# EAGLE schematic ShutdownCircuitFH rev1 (EAGLE 8.3.1)
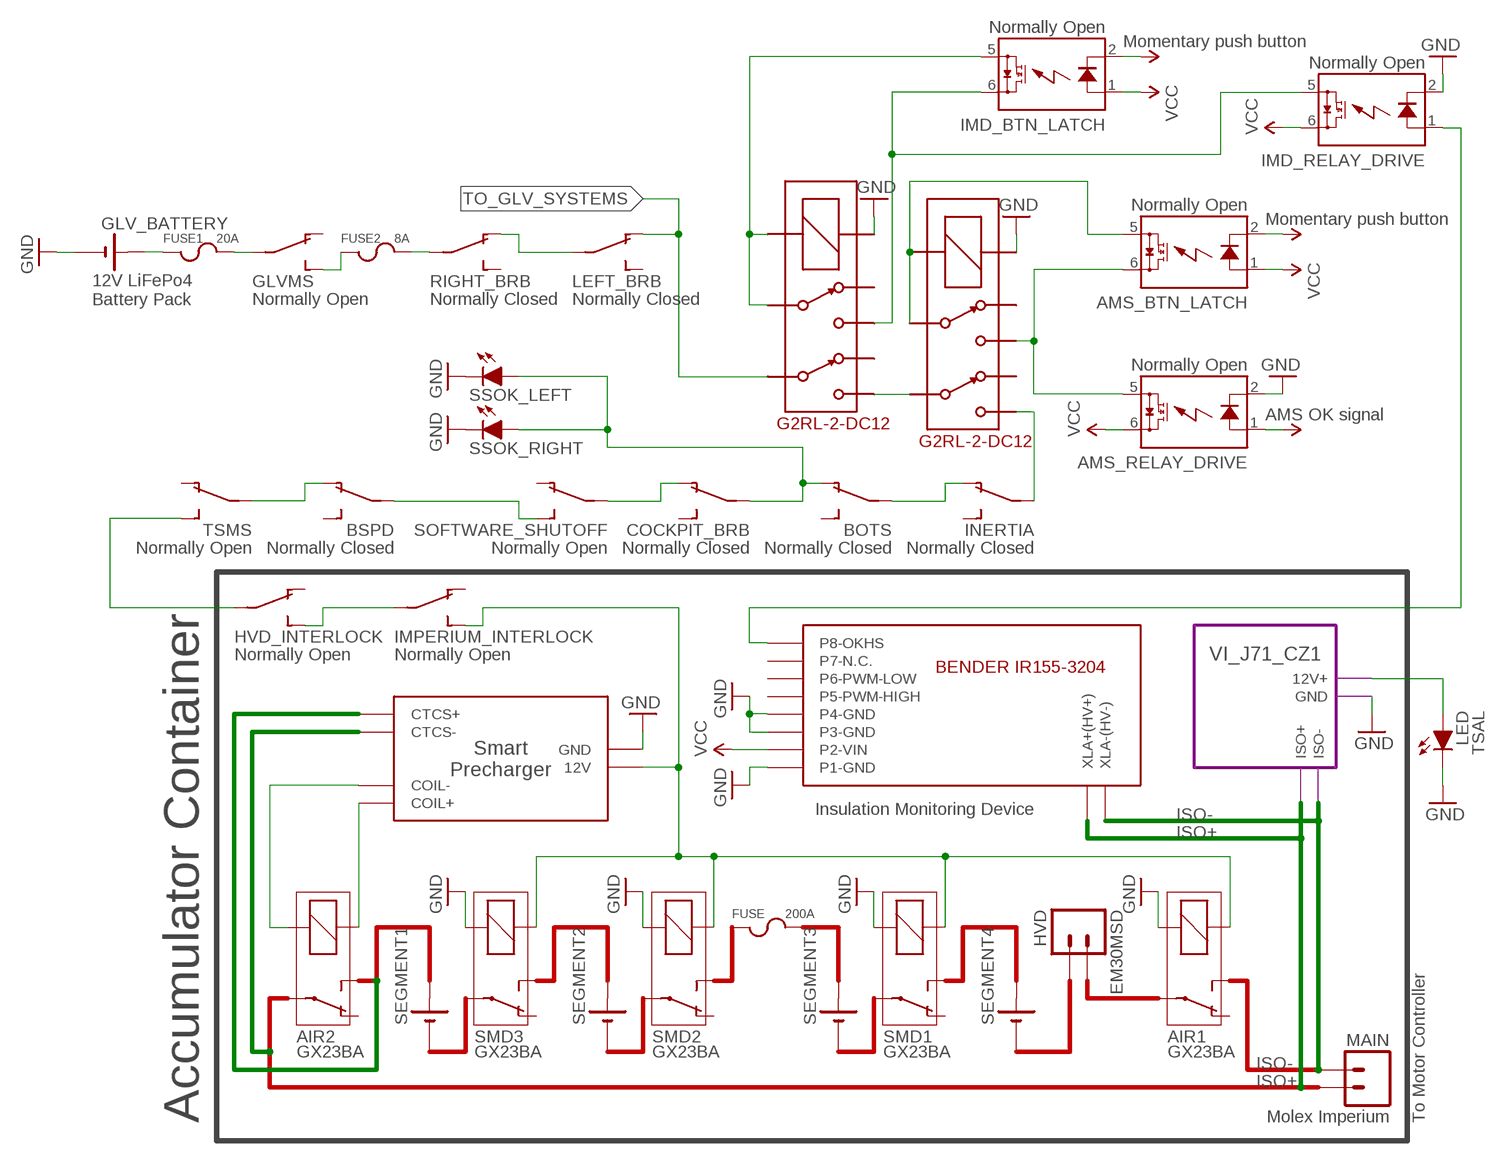
[diagram p0: schematic, sheet 1]

## Parts
AIR1  GX23BA  RELAY  (no package)
AIR2  GX23BA  RELAY  (no package)
AMS_BTN_LATCH  Normally Open  SOLID_STATE_RELAY_VO14642AT  [DIL06]
AMS_RELAY_DRIVE  Normally Open  SOLID_STATE_RELAY_VO14642AT  [DIL06]
BOTS  Normally Closed  SWITCH_SPST  (no package)
BSPD  Normally Closed  SWITCH_SPST  (no package)
COCKPIT_BRB  Normally Closed  SWITCH_SPST  (no package)
FUSE  200A  FUSE  (no package)
FUSE1  20A  FUSE  (no package)
FUSE2  8A  FUSE  (no package)
GLV_BATTERY  BATTERY_1_CELL  (no package)
GLVMS  Normally Open  SWITCH_SPST  (no package)
HVD  EM30MSD  M02  (no package)
HVD_INTERLOCK  Normally Open  SWITCH_SPST  (no package)
IMD_BTN_LATCH  Normally Open  SOLID_STATE_RELAY_VO14642AT  [DIL06]
IMD_RELAY_DRIVE  Normally Open  SOLID_STATE_RELAY_VO14642AT  [DIL06]
IMPERIUM_INTERLOCK  Normally Open  SWITCH_SPST  (no package)
INERTIA  Normally Closed  SWITCH_SPST  (no package)
LEFT_BRB  Normally Closed  SWITCH_SPST  (no package)
MAIN  Molex Imperium  M02  (no package)
RIGHT_BRB  Normally Closed  SWITCH_SPST  (no package)
SEGMENT1  BATTERY_1_CELL  (no package)
SEGMENT2  BATTERY_1_CELL  (no package)
SEGMENT3  BATTERY_1_CELL  (no package)
SEGMENT4  BATTERY_1_CELL  (no package)
SMD1  GX23BA  RELAY  (no package)
SMD2  GX23BA  RELAY  (no package)
SMD3  GX23BA  RELAY  (no package)
SOFTWARE_SHUTOFF  Normally Open  SWITCH_SPST  (no package)
SSOK_LEFT  LED-0805  [LED-805]
SSOK_RIGHT  LED-0805  [LED-805]
TSAL  LED  (no package)
TSMS  Normally Open  SWITCH_SPST  (no package)
U$1  G2RL-2-DC12  [G2RL-2]
U$2  BENDER_IR155-3204  (no package)
U$3  SMART_PRECHARGER  (no package)
U$4  G2RL-2-DC12  [G2RL-2]

## Module instances
VI_J71_CZ1 = VICOR_VI_J71_CZ

## Nets
GND: AIR1.2 AMS_RELAY_DRIVE.2(LED-) GLV_BATTERY.- IMD_RELAY_DRIVE.2(LED-) SMD1.2 SMD2.2 SMD3.2 SSOK_LEFT.C SSOK_RIGHT.C TSAL.C U$1.COIL+ U$2.P1-GND U$2.P3-GND U$2.P4-GND U$3.GND U$4.COIL+ ; port VI_J71_CZ1.GND
ISO+: U$2.XLA+(HV+) U$3.CTCS- ; port VI_J71_CZ1.ISO+
ISO-: MAIN.2 U$2.XLA-(HV-) ; port VI_J71_CZ1.ISO-
N$1: FUSE1.1 GLV_BATTERY.+
N$2: FUSE2.1 GLVMS.S
N$3: LEFT_BRB.P RIGHT_BRB.O
N$4: IMD_RELAY_DRIVE.1(LED+) U$2.P8-OKHS
N$5: U$1.5 U$4.6
N$6: IMD_BTN_LATCH.5(IO2) U$1.3 U$1.COIL-
N$7: BSPD.P SOFTWARE_SHUTOFF.S
N$8: INERTIA.P U$4.5
N$9: COCKPIT_BRB.O SOFTWARE_SHUTOFF.P
N$11: BSPD.O TSMS.P
N$12: HVD_INTERLOCK.P TSMS.S
N$13: AMS_BTN_LATCH.6(IO1) AMS_RELAY_DRIVE.5(IO2) U$4.4
N$14: TSAL.A ; port VI_J71_CZ1.12V+
N$16: AMS_BTN_LATCH.5(IO2) U$4.3 U$4.COIL-
N$17: BOTS.P INERTIA.O
N$18: AIR2.2 U$3.COIL-
N$19: AIR2.1 U$3.COIL+
N$21: FUSE1.2 GLVMS.P
N$22: U$3.CTCS+
N$23: FUSE2.2 RIGHT_BRB.P
N$24: IMD_BTN_LATCH.6(IO1) IMD_RELAY_DRIVE.5(IO2) U$1.4
N$25: HVD_INTERLOCK.S IMPERIUM_INTERLOCK.P
SHUTDOWN_CIRCUIT: AIR1.1 IMPERIUM_INTERLOCK.S SMD1.1 SMD2.1 SMD3.1 U$3.12V
TO_GLV_SYSTEMS: LEFT_BRB.O U$1.6
TO_SSOK_LAMPS: BOTS.O COCKPIT_BRB.P SSOK_LEFT.A SSOK_RIGHT.A
VIN: AMS_BTN_LATCH.1(LED+) AMS_BTN_LATCH.2(LED-) AMS_RELAY_DRIVE.1(LED+) AMS_RELAY_DRIVE.6(IO1) IMD_BTN_LATCH.1(LED+) IMD_BTN_LATCH.2(LED-) IMD_RELAY_DRIVE.6(IO1) U$2.P2-VIN ; supply symbol labelled VCC
Unconnected: AIR1.O AIR1.P AIR1.S AIR2.O AIR2.P AIR2.S BOTS.S BSPD.S COCKPIT_BRB.S FUSE.1 FUSE.2 GLVMS.O HVD.1 HVD.2 HVD_INTERLOCK.O IMPERIUM_INTERLOCK.O INERTIA.S LEFT_BRB.S MAIN.1 RIGHT_BRB.S SEGMENT1.+ SEGMENT1.- SEGMENT2.+ SEGMENT2.- SEGMENT3.+ SEGMENT3.- SEGMENT4.+ SEGMENT4.- SMD1.O SMD1.P SMD1.S SMD2.O SMD2.P SMD2.S SMD3.O SMD3.P SMD3.S SOFTWARE_SHUTOFF.O TSMS.O U$1.2 U$1.7 U$2.P5-PWM-HIGH U$2.P6-PWM-LOW U$2.P7-N.C. U$4.2 U$4.7

## Notes on the sheet
- Momentary push button
- Momentary push button
- 12V LiFePo4
  Battery Pack
- AMS OK signal
- Insulation Monitoring Device
- Accumulator Container | To Motor Controller

## Library data of the parts
AIR1 AIR2 SMD1-SMD3 = HyTechSymbols:RELAY: RELAY 1 x switch
AMS_BTN_LATCH AMS_RELAY_DRIVE IMD_BTN_LATCH IMD_RELAY_DRIVE = HyTechDevices:SOLID_STATE_RELAY
BOTS BSPD COCKPIT_BRB GLVMS HVD_INTERLOCK IMPERIUM_INTERLOCK INERTIA LEFT_BRB RIGHT_BRB SOFTWARE_SHUTOFF TSMS = HyTechSymbols:SWITCH_SPST: Single Pull Single Throw Switch
FUSE FUSE1 FUSE2 = HyTechSymbols:FUSE: Generic Fuse
GLV_BATTERY SEGMENT1-SEGMENT4 = HyTechSymbols:BATTERY_1_CELL: Generic 1-cell battery Source: Sonnenschein
HVD MAIN = HyTechSymbols:M02: Generic 2-pin connector
SSOK_LEFT SSOK_RIGHT = HyTechDevices:LED: Light Emitting Diode (LED) Source: Dangerous Prototypes Eagle Library <https://github.com/DangerousPrototypes/Eagle_Part_Library>
TSAL = HyTechSymbols:LED: Generic LED
U$1 U$4 = HyTechDevices:G2RL-2-DC12: Omron G2RL-2 Double Pull Double Throw Relay Coil Voltage: 12VDC (8.4-18VDC @60ºC) Contact Amperage: 8A at 30VDC Datasheet <https://www.omron.com/ecb/products/pdf/en-g2rl.pdf>
U$2 = HyTechSymbols:BENDER_IR155-3204: Bender IR155-3204 Insulation Monitoring Device Datasheet <http://www.bender-es.com/fileadmin/products/doc/IR155-32xx-V004_D00115_D_XXEN.pdf>
U$3 = HyTechSymbols:SMART_PRECHARGER: Smart Precharger http://www.zeva.com.au/Products/datasheets/SmartPrechargerV1-3.pdf

## Module VICOR_VI_J71_CZ
Ports: 12V+(out) GND(in) ISO+(in) ISO-(out)

### Library data of the parts